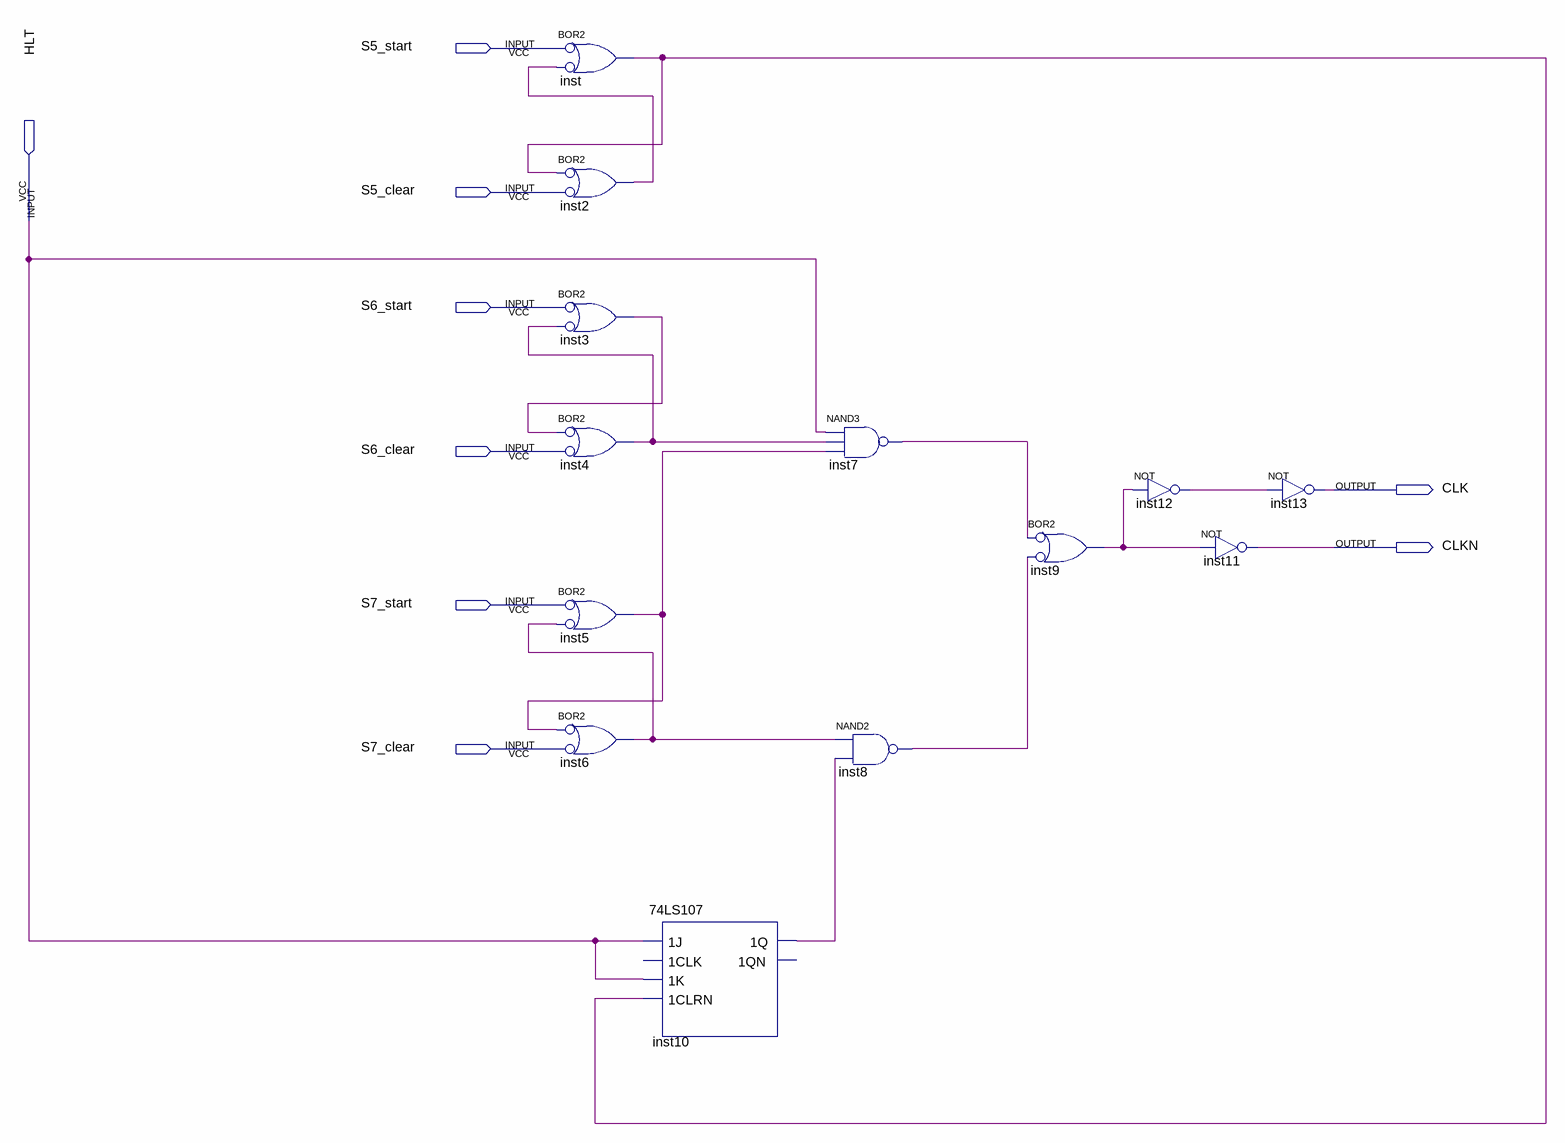
[diagram p0: schematic sheet]
// Quartus schematic Circuito gerador de clock e do sinal de reset.bdf as structural Verilog: 13 symbols, 9 pins
module \Circuito_gerador_de_clock_e_do_sinal_de_reset  (
  input  S5_start,
  input  S5_clear,
  input  HLT,
  input  S6_start,
  input  S6_clear,
  input  S7_start,
  input  S7_clear,
  output CLK,
  output CLKN
);

  wire inst2_out, inst3_out, inst4_out, inst5_out, inst6_out, inst7_out, inst8_out, inst9_out, inst10_1q,
       inst12_out, inst_out;

  or inst (inst_out, ~S5_start, ~inst2_out);  // BOR2
  or inst2 (inst2_out, ~inst_out, ~S5_clear);  // BOR2
  or inst3 (inst3_out, ~S6_start, ~inst4_out);  // BOR2
  or inst4 (inst4_out, ~inst3_out, ~S6_clear);  // BOR2
  or inst5 (inst5_out, ~S7_start, ~inst6_out);  // BOR2
  or inst6 (inst6_out, ~inst5_out, ~S7_clear);  // BOR2
  \74LS107  inst10 (.\1J (HLT), .\1K (HLT), .\1CLRN (inst_out), .\1Q (inst10_1q));  // open: 1CLK, 1QN
  nand inst7 (inst7_out, HLT, inst4_out, inst5_out);
  nand inst8 (inst8_out, inst6_out, inst10_1q);
  or inst9 (inst9_out, ~inst7_out, ~inst8_out);  // BOR2
  not inst12 (inst12_out, inst9_out);
  not inst11 (CLKN, inst9_out);
  not inst13 (CLK, inst12_out);
endmodule
